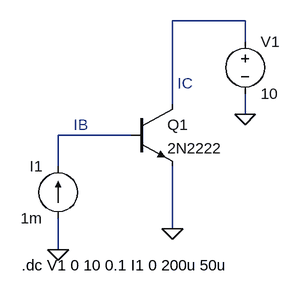
[diagram p0: schematic Assignment 4.1 BJT Different Ib.asc]
Assignment 4.1 BJT Different Ib.asc, the LTspice schematic file:
Version 4.1
SHEET 1 880 680
WIRE 336 -16 224 -16
WIRE 336 16 336 -16
WIRE 224 112 224 -16
WIRE 336 128 336 96
WIRE 160 160 48 160
WIRE 48 208 48 160
WIRE 224 304 224 208
WIRE 48 336 48 288
FLAG 48 336 0
FLAG 224 304 0
FLAG 336 128 0
SYMBOL npn 160 112 R0
SYMATTR InstName Q1
SYMATTR Value 2N2222
SYMBOL voltage 336 0 R0
SYMATTR InstName V1
SYMATTR Value 10
SYMBOL current 48 288 R180
WINDOW 0 24 80 Left 2
WINDOW 3 24 0 Left 2
SYMATTR InstName I1
SYMATTR Value 1m
TEXT 72 144 Left 2 ;IB
TEXT 232 80 Left 2 ;IC
TEXT -8 360 Left 2 !.dc V1 0 10 0.1 I1 0 200u 50u

The netlist it stands for:
* Assignment 4.1 BJT Different Ib.asc
Q1 N001 N002 0 0 2N2222
V1 N001 0 10
I1 0 N002 1m
.model NPN NPN
.model PNP PNP
.lib standard.bjt
* IB
* IC
.dc V1 0 10 0.1 I1 0 200u 50u
.backanno
.end